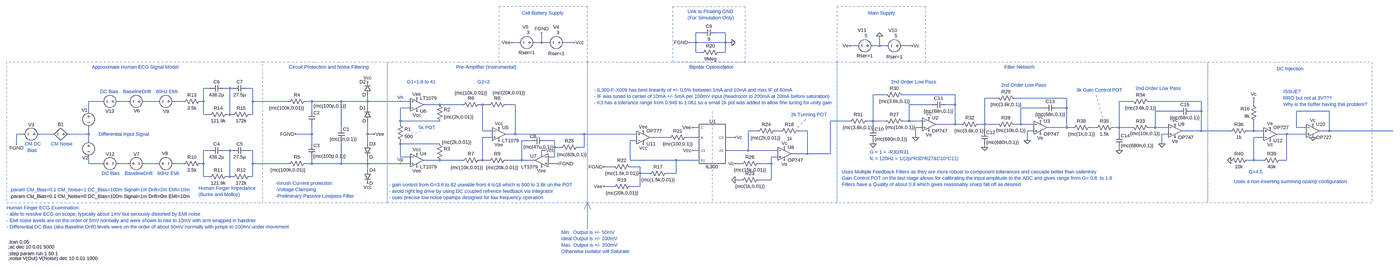
[diagram p0: schematic FrontEnd.asc, whole sheet]
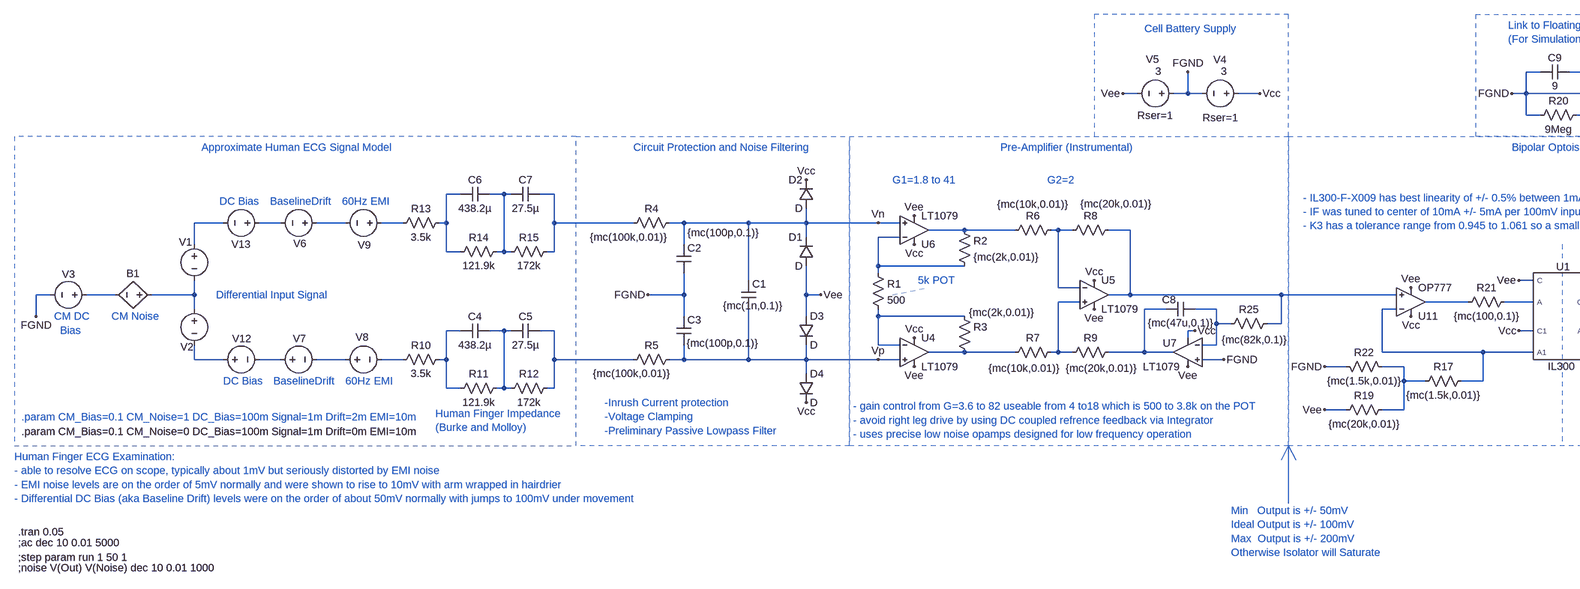
[diagram p1: schematic FrontEnd.asc, part, row 1 of 1, column 1 of 2]
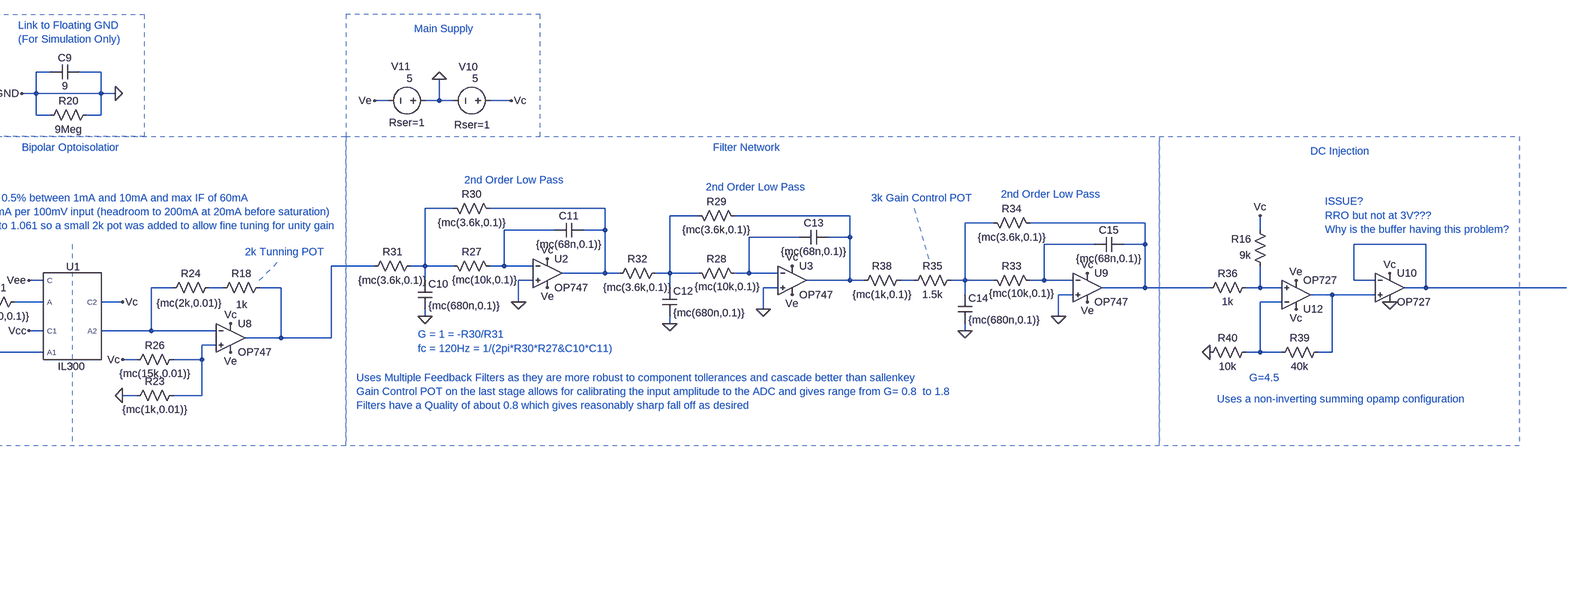
[diagram p2: schematic FrontEnd.asc, part, row 1 of 1, column 2 of 2]
FrontEnd.asc, the LTspice schematic file:
Version 4
SHEET 1 5396 1760
WIRE 1808 -256 1776 -256
WIRE 1920 -256 1872 -256
WIRE 912 -208 880 -208
WIRE 1024 -208 1024 -256
WIRE 1024 -208 992 -208
WIRE 1056 -208 1024 -208
WIRE 1184 -208 1136 -208
WIRE 1776 -208 1776 -256
WIRE 1776 -208 1744 -208
WIRE 1920 -208 1920 -256
WIRE 1920 -208 1776 -208
WIRE 1952 -208 1920 -208
WIRE 2560 -192 2528 -192
WIRE 2672 -192 2672 -240
WIRE 2672 -192 2640 -192
WIRE 2704 -192 2672 -192
WIRE 2832 -192 2784 -192
WIRE 1776 -160 1776 -208
WIRE 1808 -160 1776 -160
WIRE 1920 -160 1920 -208
WIRE 1920 -160 1888 -160
WIRE -592 16 -624 16
WIRE -496 16 -528 16
WIRE -480 16 -496 16
WIRE -384 16 -416 16
WIRE 2704 48 2640 48
WIRE 3040 48 2784 48
WIRE 3248 64 3184 64
WIRE 3584 64 3328 64
WIRE -1120 80 -1184 80
WIRE -992 80 -1040 80
WIRE -848 80 -912 80
WIRE -720 80 -768 80
WIRE -624 80 -624 16
WIRE -624 80 -640 80
WIRE -384 80 -384 16
WIRE -208 80 -384 80
WIRE -96 80 -128 80
WIRE 48 80 -96 80
WIRE 176 80 176 48
WIRE 176 80 48 80
WIRE 336 80 176 80
WIRE 384 80 336 80
WIRE 3904 80 3840 80
WIRE 4240 80 3984 80
WIRE 528 96 448 96
WIRE 640 96 528 96
WIRE 736 96 720 96
WIRE 768 96 736 96
WIRE 896 96 848 96
WIRE 2928 96 2816 96
WIRE 3040 96 3040 48
WIRE 3040 96 2992 96
WIRE 4496 96 4496 64
WIRE 176 112 176 80
WIRE 384 112 336 112
WIRE 3472 112 3360 112
WIRE 3584 112 3584 64
WIRE 3584 112 3536 112
WIRE -1184 128 -1184 80
WIRE -96 128 -96 80
WIRE 4128 128 4016 128
WIRE 4240 128 4240 80
WIRE 4240 128 4192 128
WIRE 4864 128 4704 128
WIRE -624 144 -624 80
WIRE -592 144 -624 144
WIRE -496 144 -496 16
WIRE -496 144 -512 144
WIRE -480 144 -496 144
WIRE -384 144 -384 80
WIRE -384 144 -400 144
WIRE 336 176 336 112
WIRE 528 176 336 176
WIRE 2528 176 2432 176
WIRE 2640 176 2640 48
WIRE 2640 176 2608 176
WIRE 2704 176 2640 176
WIRE 2816 176 2816 96
WIRE 2816 176 2784 176
WIRE 2880 176 2816 176
WIRE 336 192 336 176
WIRE 3040 192 3040 96
WIRE 3040 192 2944 192
WIRE 3072 192 3040 192
WIRE 3184 192 3184 64
WIRE 3184 192 3152 192
WIRE 3248 192 3184 192
WIRE 3360 192 3360 112
WIRE 3360 192 3328 192
WIRE 3424 192 3360 192
WIRE 48 208 48 80
WIRE 1792 208 1760 208
WIRE 2640 208 2640 176
WIRE 2880 208 2848 208
WIRE 3584 208 3584 112
WIRE 3584 208 3488 208
WIRE 3616 208 3584 208
WIRE 3728 208 3696 208
WIRE 3840 208 3840 80
WIRE 3840 208 3808 208
WIRE 3904 208 3840 208
WIRE 4016 208 4016 128
WIRE 4016 208 3984 208
WIRE 4080 208 4016 208
WIRE 4704 208 4704 128
WIRE 4752 208 4704 208
WIRE 736 224 736 96
WIRE 784 224 736 224
WIRE 2080 224 2032 224
WIRE 2192 224 2160 224
WIRE 2320 224 2272 224
WIRE 3184 224 3184 192
WIRE 3424 224 3392 224
WIRE 4240 224 4240 128
WIRE 4240 224 4144 224
WIRE 4384 224 4240 224
WIRE 4496 224 4496 176
WIRE 4496 224 4464 224
WIRE 4544 224 4496 224
WIRE 4864 224 4864 128
WIRE 4864 224 4816 224
WIRE 5392 224 4864 224
WIRE -1504 240 -1536 240
WIRE -1360 240 -1424 240
WIRE -1184 240 -1184 208
WIRE -1184 240 -1280 240
WIRE -96 240 -96 192
WIRE -96 240 -176 240
WIRE 176 240 176 176
WIRE 208 240 176 240
WIRE 896 240 896 96
WIRE 896 240 848 240
WIRE 1232 240 896 240
WIRE 1488 240 1232 240
WIRE 3840 240 3840 208
WIRE 4080 240 4048 240
WIRE 4656 240 4608 240
WIRE 4752 240 4656 240
WIRE 784 256 736 256
WIRE 1648 256 1552 256
WIRE 1792 256 1728 256
WIRE 1968 256 1920 256
WIRE 2848 256 2848 208
WIRE 4544 256 4496 256
WIRE -1184 272 -1184 240
WIRE 976 272 928 272
WIRE 1088 272 1040 272
WIRE 1488 272 1456 272
WIRE 3392 272 3392 224
WIRE -1536 288 -1536 240
WIRE -96 288 -96 240
WIRE 176 288 176 240
WIRE 336 288 336 272
WIRE 528 288 336 288
WIRE 2640 288 2640 272
WIRE 4048 288 4048 240
WIRE 1088 304 1088 272
WIRE 1120 304 1088 304
WIRE 1232 304 1232 240
WIRE 1232 304 1200 304
WIRE 3184 304 3184 288
WIRE -592 320 -624 320
WIRE -496 320 -528 320
WIRE -480 320 -496 320
WIRE -384 320 -416 320
WIRE 1040 320 1024 320
WIRE 1792 320 1760 320
WIRE 2032 320 2032 224
WIRE 2032 320 1920 320
WIRE 2176 320 2032 320
WIRE 3840 320 3840 304
WIRE 1024 336 1024 320
WIRE 2320 336 2320 224
WIRE 2320 336 2240 336
WIRE 2432 336 2432 176
WIRE 2432 336 2320 336
WIRE 336 352 336 288
WIRE 384 352 336 352
WIRE 1088 352 1088 304
WIRE 1088 352 1056 352
WIRE 2176 352 2144 352
WIRE 528 368 448 368
WIRE 640 368 528 368
WIRE 736 368 736 256
WIRE 736 368 720 368
WIRE 768 368 736 368
WIRE 928 368 928 272
WIRE 928 368 848 368
WIRE 992 368 928 368
WIRE 1456 368 1456 272
WIRE 1680 368 1456 368
WIRE 1792 368 1680 368
WIRE 4496 368 4496 256
WIRE 4496 368 4464 368
WIRE 4544 368 4496 368
WIRE 4656 368 4656 240
WIRE 4656 368 4624 368
WIRE -1184 384 -1184 352
WIRE -1120 384 -1184 384
WIRE -992 384 -1040 384
WIRE -848 384 -912 384
WIRE -720 384 -768 384
WIRE -624 384 -624 320
WIRE -624 384 -640 384
WIRE -384 384 -384 320
WIRE -208 384 -384 384
WIRE -96 384 -96 352
WIRE -96 384 -128 384
WIRE 48 384 48 272
WIRE 48 384 -96 384
WIRE 176 384 176 352
WIRE 176 384 48 384
WIRE 336 384 176 384
WIRE 384 384 336 384
WIRE 1104 384 1056 384
WIRE 2000 384 1968 384
WIRE 2144 384 2144 352
WIRE 2144 384 2080 384
WIRE 1376 400 1328 400
WIRE 1504 400 1456 400
WIRE 176 416 176 384
WIRE 1504 432 1504 400
WIRE 1552 432 1504 432
WIRE 1680 432 1680 368
WIRE 1680 432 1632 432
WIRE -624 448 -624 384
WIRE -592 448 -624 448
WIRE -496 448 -496 320
WIRE -496 448 -512 448
WIRE -480 448 -496 448
WIRE -384 448 -384 384
WIRE -384 448 -400 448
WIRE 2000 464 1968 464
WIRE 2144 464 2144 384
WIRE 2144 464 2080 464
WIRE 1376 496 1328 496
WIRE 1504 496 1504 432
WIRE 1504 496 1456 496
FLAG 880 -208 Vee
FLAG 1184 -208 Vcc
FLAG 416 128 Vcc
FLAG 416 336 Vcc
FLAG 416 64 Vee
FLAG 416 400 Vee
FLAG 208 240 Vee
FLAG 176 480 Vcc
FLAG 176 -16 Vcc
FLAG 816 208 Vcc
FLAG 816 272 Vee
FLAG 1520 224 Vee
FLAG 1520 288 Vcc
FLAG 1760 320 Vcc
FLAG 2672 -240 0
FLAG 2528 -192 Ve
FLAG 2832 -192 Vc
FLAG 1968 256 Vc
FLAG 1024 -256 FGND
FLAG -1536 288 FGND
FLAG -176 240 FGND
FLAG 1952 -208 0
FLAG 1744 -208 FGND
FLAG 2208 304 Vc
FLAG 2208 368 Ve
FLAG 1760 208 Vee
FLAG 1328 496 Vee
FLAG 1968 384 Vc
FLAG 1968 464 0
FLAG 1328 400 FGND
FLAG 1104 384 FGND
FLAG 1024 400 Vee
FLAG 1040 320 Vcc
FLAG 336 384 Vp
FLAG 336 80 Vn
FLAG 2912 160 Vc
FLAG 2912 224 Ve
FLAG 2640 288 0
FLAG 2848 256 0
FLAG 3184 304 0
FLAG 3392 272 0
FLAG 3840 320 0
FLAG 4048 288 0
FLAG 3456 176 Vc
FLAG 3456 240 Ve
FLAG 4112 192 Vc
FLAG 4112 256 Ve
FLAG 4576 208 Ve
FLAG 4576 272 Vc
FLAG 4784 192 Vc
FLAG 4384 368 0
FLAG 4496 64 Vc
FLAG 4784 256 0
SYMBOL voltage -1184 112 R0
WINDOW 3 24 96 Invisible 2
WINDOW 39 0 0 Left 2
WINDOW 0 -34 11 Left 2
SYMATTR Value SINE(0 {Signal/2} 10)
SYMATTR InstName V1
SYMATTR Value2 AC {Signal/2}
SYMBOL voltage 1152 -208 R90
WINDOW 123 0 0 Left 2
WINDOW 39 54 16 VRight 2
WINDOW 0 -75 42 VRight 2
WINDOW 3 -49 41 VRight 2
SYMATTR SpiceLine Rser=1
SYMATTR InstName V4
SYMATTR Value 3
SYMBOL voltage 1008 -208 R90
WINDOW 123 0 0 Left 2
WINDOW 39 49 17 VRight 2
WINDOW 0 -76 48 VRight 2
WINDOW 3 -49 43 VRight 2
SYMATTR SpiceLine Rser=1
SYMATTR InstName V5
SYMATTR Value 3
SYMBOL res 320 176 R0
SYMATTR Value 500
SYMATTR InstName R1
SYMBOL res 512 80 R0
SYMATTR InstName R2
SYMATTR Value {mc(2k,0.01)}
SYMBOL res 512 272 R0
WINDOW 3 26 7 Left 2
SYMATTR Value {mc(2k,0.01)}
SYMATTR InstName R3
SYMBOL diode 192 176 R180
WINDOW 0 24 64 Left 2
WINDOW 3 24 0 Left 2
SYMATTR InstName D1
SYMBOL diode 192 48 R180
WINDOW 0 24 64 Left 2
WINDOW 3 24 0 Left 2
SYMATTR InstName D2
SYMBOL diode 160 288 R0
SYMATTR InstName D3
SYMBOL diode 160 416 R0
SYMATTR InstName D4
SYMBOL res -112 64 R90
WINDOW 0 0 56 VBottom 2
WINDOW 3 32 107 VTop 2
SYMATTR InstName R4
SYMATTR Value {mc(100k,0.01)}
SYMBOL res -112 368 R90
WINDOW 0 0 56 VBottom 2
WINDOW 3 32 100 VTop 2
SYMATTR InstName R5
SYMATTR Value {mc(100k,0.01)}
SYMBOL res 736 80 R90
WINDOW 0 0 56 VBottom 2
WINDOW 3 -57 57 VTop 2
SYMATTR InstName R6
SYMATTR Value {mc(10k,0.01)}
SYMBOL res 736 352 R90
WINDOW 0 0 56 VBottom 2
WINDOW 3 36 76 VTop 2
SYMATTR InstName R7
SYMATTR Value {mc(10k,0.01)}
SYMBOL res 864 80 R90
WINDOW 0 0 56 VBottom 2
WINDOW 3 -58 0 VTop 2
SYMATTR InstName R8
SYMATTR Value {mc(20k,0.01)}
SYMBOL res 864 352 R90
WINDOW 0 0 56 VBottom 2
WINDOW 3 36 32 VTop 2
SYMATTR InstName R9
SYMATTR Value {mc(20k,0.01)}
SYMBOL voltage -1184 256 R0
WINDOW 3 24 96 Invisible 2
WINDOW 39 0 0 Left 2
WINDOW 0 -31 100 Left 2
SYMATTR Value SINE(0 {Signal/2} 10)
SYMATTR InstName V2
SYMATTR Value2 AC {Signal/2}
SYMBOL cap 32 208 R0
WINDOW 3 -41 56 Left 2
SYMATTR Value {mc(1n,0.1)}
SYMATTR InstName C1
SYMBOL cap -112 128 R0
WINDOW 3 24 -26 Left 2
SYMATTR Value {mc(100p,0.1)}
SYMATTR InstName C2
SYMBOL cap -112 288 R0
WINDOW 3 22 60 Left 2
SYMATTR Value {mc(100p,0.1)}
SYMATTR InstName C3
SYMBOL bv -1264 240 R90
WINDOW 0 -32 56 VBottom 2
WINDOW 3 32 56 Invisible 2
SYMATTR InstName B1
SYMATTR Value V=white(1e4*time)*{CM_Noise}
SYMBOL voltage -1408 240 R90
WINDOW 3 46 51 Invisible 2
WINDOW 39 0 0 Left 2
WINDOW 0 -46 41 VRight 2
WINDOW 123 0 0 Left 2
SYMATTR Value {CM_Bias}
SYMATTR InstName V3
SYMBOL Opamps\\LT1079 416 304 R0
SYMATTR InstName U4
SYMBOL Opamps\\LT1079 816 176 R0
SYMATTR InstName U5
SYMBOL Opamps\\LT1079 416 160 M180
SYMATTR InstName U6
SYMBOL voltage -896 80 R90
WINDOW 3 43 0 Invisible 2
WINDOW 39 0 0 Left 2
WINDOW 0 46 39 VRight 2
WINDOW 123 0 0 Left 2
SYMATTR Value SINE(0 {Drift/2} 0.5)
SYMATTR InstName V6
SYMBOL voltage -1008 384 R270
WINDOW 3 -41 -57 Invisible 2
WINDOW 39 0 0 Left 2
WINDOW 0 46 43 VRight 2
WINDOW 123 0 0 Left 2
SYMATTR Value SINE(0 {Drift/2} 0.5)
SYMATTR InstName V7
SYMBOL res -624 368 R90
WINDOW 0 0 56 VBottom 2
WINDOW 3 32 56 VTop 2
SYMATTR InstName R10
SYMATTR Value 3.5k
SYMBOL res -496 432 R90
WINDOW 0 0 56 VBottom 2
WINDOW 3 32 56 VTop 2
SYMATTR InstName R11
SYMATTR Value 121.9k
SYMBOL cap -528 304 R90
WINDOW 0 0 32 VBottom 2
WINDOW 3 32 32 VTop 2
SYMATTR InstName C4
SYMATTR Value 438.2µ
SYMBOL cap -416 304 R90
WINDOW 0 0 32 VBottom 2
WINDOW 3 32 32 VTop 2
SYMATTR InstName C5
SYMATTR Value 27.5µ
SYMBOL res -384 432 R90
WINDOW 0 0 56 VBottom 2
WINDOW 3 32 56 VTop 2
SYMATTR InstName R12
SYMATTR Value 172k
SYMBOL res -624 64 R90
WINDOW 0 0 56 VBottom 2
WINDOW 3 32 56 VTop 2
SYMATTR InstName R13
SYMATTR Value 3.5k
SYMBOL res -496 128 R90
WINDOW 0 0 56 VBottom 2
WINDOW 3 32 56 VTop 2
SYMATTR InstName R14
SYMATTR Value 121.9k
SYMBOL cap -528 0 R90
WINDOW 0 0 32 VBottom 2
WINDOW 3 32 32 VTop 2
SYMATTR InstName C6
SYMATTR Value 438.2µ
SYMBOL cap -416 0 R90
WINDOW 0 0 32 VBottom 2
WINDOW 3 32 32 VTop 2
SYMATTR InstName C7
SYMATTR Value 27.5µ
SYMBOL res -384 128 R90
WINDOW 0 0 56 VBottom 2
WINDOW 3 32 56 VTop 2
SYMATTR InstName R15
SYMATTR Value 172k
SYMBOL voltage -864 384 R270
WINDOW 3 -41 -14 Invisible 2
WINDOW 39 0 0 Left 2
WINDOW 0 50 38 VRight 2
WINDOW 123 0 0 Left 2
SYMATTR Value SINE(0 {EMI/2} 60)
SYMATTR InstName V8
SYMBOL voltage -752 80 R90
WINDOW 3 43 -38 Invisible 2
WINDOW 39 0 0 Left 2
WINDOW 0 49 39 VRight 2
WINDOW 123 0 0 Left 2
SYMATTR Value SINE(0 {EMI/2} 60)
SYMATTR InstName V9
SYMBOL res 1648 416 R90
WINDOW 0 0 56 VBottom 2
WINDOW 3 32 56 VTop 2
SYMATTR InstName R17
SYMATTR Value {mc(1.5k,0.01)}
SYMBOL res 2288 208 R90
WINDOW 0 0 56 VBottom 2
WINDOW 3 38 55 VTop 2
SYMATTR InstName R18
SYMATTR Value 1k
SYMBOL voltage 2800 -192 R90
WINDOW 123 0 0 Left 2
WINDOW 39 54 16 VRight 2
WINDOW 0 -75 42 VRight 2
WINDOW 3 -49 41 VRight 2
SYMATTR SpiceLine Rser=1
SYMATTR InstName V10
SYMATTR Value 5
SYMBOL voltage 2656 -192 R90
WINDOW 123 0 0 Left 2
WINDOW 39 49 17 VRight 2
WINDOW 0 -76 48 VRight 2
WINDOW 3 -49 43 VRight 2
SYMATTR SpiceLine Rser=1
SYMATTR InstName V11
SYMATTR Value 5
SYMBOL res 1904 -176 R90
WINDOW 0 0 56 VBottom 2
WINDOW 3 32 56 VTop 2
SYMATTR InstName R20
SYMATTR Value 9Meg
SYMBOL IL300 1856 288 R0
WINDOW 3 -1 111 Center 2
WINDOW 0 -13 -110 Left 2
SYMATTR InstName U1
SYMBOL res 1744 240 R90
WINDOW 0 0 56 VBottom 2
WINDOW 3 32 56 VTop 2
SYMATTR InstName R21
SYMATTR Value {mc(100,0.1)}
SYMBOL res 1984 400 R270
WINDOW 0 32 56 VTop 2
WINDOW 3 0 56 VBottom 2
SYMATTR InstName R26
SYMATTR Value {mc(15k,0.01)}
SYMBOL res 1472 480 R90
WINDOW 0 0 56 VBottom 2
WINDOW 3 32 56 VTop 2
SYMATTR InstName R19
SYMATTR Value {mc(20k,0.01)}
SYMBOL res 1360 384 M90
WINDOW 0 0 56 VBottom 2
WINDOW 3 32 56 VTop 2
SYMATTR InstName R22
SYMATTR Value {mc(1.5k,0.01)}
SYMBOL res 1984 480 R270
WINDOW 0 32 56 VTop 2
WINDOW 3 0 56 VBottom 2
SYMATTR InstName R23
SYMATTR Value {mc(1k,0.01)}
SYMBOL res 2176 208 R90
WINDOW 0 0 56 VBottom 2
WINDOW 3 35 60 VTop 2
SYMATTR InstName R24
SYMATTR Value {mc(2k,0.01)}
SYMBOL voltage -1136 384 R270
WINDOW 3 -43 50 Invisible 2
WINDOW 39 0 0 Left 2
WINDOW 0 46 36 VRight 2
WINDOW 123 0 0 Left 2
SYMATTR Value {DC_Bias/2}
SYMATTR InstName V12
SYMBOL voltage -1024 80 R90
WINDOW 3 -43 50 Invisible 2
WINDOW 39 0 0 Left 2
WINDOW 0 48 35 VRight 2
WINDOW 123 0 0 Left 2
SYMATTR Value {DC_Bias/2}
SYMATTR InstName V13
SYMBOL Opamps\\LT1079 1024 304 M0
WINDOW 0 25 44 Left 2
WINDOW 3 17 96 Left 2
SYMATTR InstName U7
SYMBOL cap 976 288 R270
WINDOW 0 21 6 VTop 2
WINDOW 3 1 32 VBottom 2
SYMATTR InstName C8
SYMATTR Value {mc(47u,0.1)}
SYMBOL res 1216 288 R90
WINDOW 0 0 56 VBottom 2
WINDOW 3 37 44 VTop 2
SYMATTR InstName R25
SYMATTR Value {mc(82k,0.1)}
SYMBOL cap 1872 -272 R90
WINDOW 0 0 32 VBottom 2
WINDOW 3 32 32 VTop 2
SYMATTR InstName C9
SYMATTR Value 9
SYMBOL res 2800 192 M270
WINDOW 0 32 56 VTop 2
WINDOW 3 1 27 VBottom 2
SYMATTR InstName R27
SYMATTR Value {mc(10k,0.1)}
SYMBOL cap 2624 272 M180
WINDOW 0 24 56 Left 2
WINDOW 3 24 8 Left 2
SYMATTR InstName C10
SYMATTR Value {mc(680n,0.1)}
SYMBOL res 2800 64 M270
WINDOW 0 32 56 VTop 2
WINDOW 3 0 56 VBottom 2
SYMATTR InstName R30
SYMATTR Value {mc(3.6k,0.1)}
SYMBOL cap 2992 112 M270
WINDOW 0 32 32 VTop 2
WINDOW 3 0 32 VBottom 2
SYMATTR InstName C11
SYMATTR Value {mc(68n,0.1)}
SYMBOL res 2624 160 R90
WINDOW 0 0 56 VBottom 2
WINDOW 3 32 56 VTop 2
SYMATTR InstName R31
SYMATTR Value {mc(3.6k,0.1)}
SYMBOL res 3344 208 M270
WINDOW 0 32 56 VTop 2
WINDOW 3 2 32 VBottom 2
SYMATTR InstName R28
SYMATTR Value {mc(10k,0.1)}
SYMBOL cap 3168 288 M180
WINDOW 0 24 56 Left 2
WINDOW 3 24 8 Left 2
SYMATTR InstName C12
SYMATTR Value {mc(680n,0.1)}
SYMBOL res 3344 80 M270
WINDOW 0 32 56 VTop 2
WINDOW 3 0 56 VBottom 2
SYMATTR InstName R29
SYMATTR Value {mc(3.6k,0.1)}
SYMBOL cap 3536 128 M270
WINDOW 0 32 32 VTop 2
WINDOW 3 0 32 VBottom 2
SYMATTR InstName C13
SYMATTR Value {mc(68n,0.1)}
SYMBOL res 3168 176 R90
WINDOW 0 0 56 VBottom 2
WINDOW 3 32 56 VTop 2
SYMATTR InstName R32
SYMATTR Value {mc(3.6k,0.1)}
SYMBOL res 4000 224 M270
WINDOW 0 32 56 VTop 2
WINDOW 3 3 34 VBottom 2
SYMATTR InstName R33
SYMATTR Value {mc(10k,0.1)}
SYMBOL cap 3824 304 M180
WINDOW 0 24 56 Left 2
WINDOW 3 24 8 Left 2
SYMATTR InstName C14
SYMATTR Value {mc(680n,0.1)}
SYMBOL res 4000 96 M270
WINDOW 0 32 56 VTop 2
WINDOW 3 0 56 VBottom 2
SYMATTR InstName R34
SYMATTR Value {mc(3.6k,0.1)}
SYMBOL cap 4192 144 M270
WINDOW 0 32 32 VTop 2
WINDOW 3 0 32 VBottom 2
SYMATTR InstName C15
SYMATTR Value {mc(68n,0.1)}
SYMBOL res 3824 192 R90
WINDOW 0 0 56 VBottom 2
WINDOW 3 32 56 VTop 2
SYMATTR InstName R35
SYMATTR Value 1.5k
SYMBOL Opamps\\OP777 1520 320 M180
SYMATTR InstName U11
SYMBOL Opamps\\OP747 2208 272 R0
SYMATTR InstName U8
SYMBOL Opamps\\OP747 2912 128 R0
SYMATTR InstName U2
SYMBOL Opamps\\OP747 3456 144 R0
SYMATTR InstName U3
SYMBOL Opamps\\OP747 4112 160 R0
SYMATTR InstName U9
SYMBOL Opamps\\OP727 4576 304 M180
SYMATTR InstName U12
SYMBOL res 4480 208 R90
WINDOW 0 0 56 VBottom 2
WINDOW 3 32 56 VTop 2
SYMATTR InstName R36
SYMATTR Value 1k
SYMBOL res 4640 352 R90
WINDOW 0 0 56 VBottom 2
WINDOW 3 32 56 VTop 2
SYMATTR InstName R39
SYMATTR Value 40k
SYMBOL res 4480 352 R90
WINDOW 0 0 56 VBottom 2
WINDOW 3 32 56 VTop 2
SYMATTR InstName R40
SYMATTR Value 10k
SYMBOL res 4512 192 R180
WINDOW 0 36 76 Left 2
WINDOW 3 36 40 Left 2
SYMATTR InstName R16
SYMATTR Value 9k
SYMBOL res 3712 192 R90
WINDOW 0 0 56 VBottom 2
WINDOW 3 32 56 VTop 2
SYMATTR InstName R38
SYMATTR Value {mc(1k,0.1)}
SYMBOL Opamps\\OP727 4784 160 R0
SYMATTR InstName U10
TEXT -1576 768 Left 2 !.tran 0.05
TEXT -1576 792 Left 2 !;ac dec 10 0.01 5000
TEXT -1576 848 Left 2 !;noise V(Out) V(Noise) dec 10 0.01 1000
TEXT -272 480 Left 2 ;-Inrush Current protection\n-Voltage Clamping\n-Preliminary Passive Lowpass Filter
TEXT -1496 288 Left 2 ;CM DC\n  Bias
TEXT -1368 288 Left 2 ;CM Noise
TEXT -1136 240 Left 2 ;Differential Input Signal
TEXT -1008 432 Left 2 ;BaselineDrift
TEXT -1168 -88 Left 2 ;Approximate Human ECG Signal Model
TEXT -648 504 Left 2 ;Human Finger Impedance\n(Burke and Molloy)
TEXT 608 -88 Left 2 ;Pre-Amplifier (Instrumental)
TEXT -848 432 Left 2 ;60Hz EMI
TEXT 928 -352 Left 2 ;Cell Battery Supply
TEXT -208 -88 Left 2 ;Circuit Protection and Noise Filtering
TEXT -1576 824 Left 2 !;step param run 1 50 1
TEXT 2616 -352 Left 2 ;Main Supply
TEXT 1736 -360 Left 2 ;Link to Floating GND\n(For Simulation Only)
TEXT 1744 -88 Left 2 ;Bipolar Optoisolatior
TEXT 1120 720 Left 2 ;Min   Output is +/- 50mV\nIdeal Output is +/- 100mV\nMax  Output is +/- 200mV\nOtherwise Isolator will Saturate
TEXT 280 488 Left 2 ;- gain control from G=3.6 to 82 useable from 4 to18 which is 500 to 3.8k on the POT\n- avoid right leg drive by using DC coupled refrence feedback via Integrator\n- uses precise low noise opamps designed for low frequency operation
TEXT 1280 24 Left 2 ;- IL300-F-X009 has best linearity of +/- 0.5% between 1mA and 10mA and max IF of 60mA\n- IF was tuned to center of 10mA +/- 5mA per 100mV input (headroom to 200mA at 20mA before saturation)\n- K3 has a tolerance range from 0.945 to 1.061 so a small 2k pot was added to allow fine tuning for unity gain
TEXT 2240 144 Left 2 ;2k Tunning POT
TEXT -1120 432 Left 2 ;DC Bias
TEXT -1016 32 Left 2 ;BaselineDrift
TEXT -856 32 Left 2 ;60Hz EMI
TEXT -1128 32 Left 2 ;DC Bias
TEXT -1568 544 Left 2 !.param CM_Bias=0.1 CM_Noise=0 DC_Bias=100m Signal=1m Drift=0m EMI=10m
TEXT 368 -16 Left 2 ;G1=1.8 to 41
TEXT 712 -16 Left 2 ;G2=2
TEXT 424 208 Left 2 ;5k POT
TEXT 2624 328 Left 2 ;G = 1 = -R30/R31\nfc = 120Hz = 1/(2pi*R30*R27&C10*C11)
TEXT 2488 424 Left 2 ;Uses Multiple Feedback Filters as they are more robust to component tollerances and cascade better than sallenkey\nGain Control POT on the last stage allows for calibrating the input amplitude to the ADC and gives range from G= 0.8  to 1.8\nFilters have a Quality of about 0.8 which gives reasonably sharp fall off as desired
TEXT 3280 -88 Left 2 ;Filter Network
TEXT -1584 600 Left 2 ;Human Finger ECG Examination:\n- able to resolve ECG on scope, typically about 1mV but seriously distorted by EMI noise\n- EMI noise levels are on the order of 5mV normally and were shown to rise to 10mV with arm wrapped in hairdrier\n- Differential DC Bias (aka Baseline Drift) levels were on the order of about 50mV normally with jumps to 100mV under movement
TEXT 3632 24 Left 2 ;3k Gain Control POT
TEXT -1568 512 Left 2 ;.param CM_Bias=0.1 CM_Noise=1 DC_Bias=100m Signal=1m Drift=2m EMI=10m
TEXT 2728 -16 Left 2 ;2nd Order Low Pass
TEXT 3264 0 Left 2 ;2nd Order Low Pass
TEXT 3920 16 Left 2 ;2nd Order Low Pass
TEXT 4640 32 Left 2 ;ISSUE?\nRRO but not at 3V???\nWhy is the buffer having this problem?
TEXT 4472 424 Left 2 ;G=4.5
TEXT 4608 -80 Left 2 ;DC Injection
TEXT 4400 472 Left 2 ;Uses a non-inverting summing opamp configuration
LINE Normal 1248 576 1248 704
LINE Normal 1248 576 1232 608
LINE Normal 1264 608 1248 576
LINE Normal 2272 208 2320 160 2
LINE Normal 368 240 448 224 2
LINE Normal 1856 128 1856 576 2
LINE Normal 3760 160 3728 48 2
RECTANGLE Normal -1584 576 -336 -112 2
RECTANGLE Normal 272 576 -336 -112 2
RECTANGLE Normal 816 -112 1248 -384 2
RECTANGLE Normal 2464 -112 2896 -384 2
RECTANGLE Normal 1248 576 272 -112 2
RECTANGLE Normal 2016 -112 1664 -384 2
RECTANGLE Normal 2464 576 1248 -112 2
RECTANGLE Normal 4272 576 2464 -112 2
RECTANGLE Normal 5072 576 4272 -112 2

The netlist it stands for:
* FrontEnd.asc
V1 N008 N028 SINE(0 {Signal/2} 10) AC {Signal/2}
V4 Vcc 0 3 Rser=1
V5 0 Vee 3 Rser=1
R1 N018 N037 500
R2 N014 N018 {mc(2k,0.01)}
R3 N037 N042 {mc(2k,0.01)}
D1 Vee Vn D
D2 Vn Vcc D
D3 Vee Vp D
D4 Vp Vcc D
R4 Vn N003 {mc(100k,0.01)}
R5 Vp N040 {mc(100k,0.01)}
R6 N015 N014 {mc(10k,0.01)}
R7 N030 N042 {mc(10k,0.01)}
R8 N016 N015 {mc(20k,0.01)}
R9 N034 N030 {mc(20k,0.01)}
V2 N028 N043 SINE(0 {Signal/2} 10) AC {Signal/2}
C1 Vn Vp {mc(1n,0.1)}
C2 Vn 0 {mc(100p,0.1)}
C3 0 Vp {mc(100p,0.1)}
B1 N028 N027 V=white(1e4*time)*{CM_Noise}
V3 N027 0 {CM_Bias}
XU4 Vp N037 Vcc Vee N042 LT1079  ; pins In+ In- V+ V- OUT
XU5 N030 N015 Vcc Vee N016 LT1079  ; pins In+ In- V+ V- OUT
XU6 Vn N018 Vcc Vee N014 LT1079  ; pins In+ In- V+ V- OUT
V6 N010 N009 SINE(0 {Drift/2} 0.5)
V7 N044 N045 SINE(0 {Drift/2} 0.5)
R10 N038 N046 3.5k
R11 N039 N038 121.9k
C4 N039 N038 438.2µ
C5 N040 N039 27.5µ
R12 N040 N039 172k
R13 N001 N011 3.5k
R14 N002 N001 121.9k
C6 N002 N001 438.2µ
C7 N003 N002 27.5µ
R15 N003 N002 172k
V8 N045 N046 SINE(0 {EMI/2} 60)
V9 N011 N010 SINE(0 {EMI/2} 60)
R17 N036 N047 {mc(1.5k,0.01)}
R18 N022 N025 1k
V10 Vc 0 5 Rser=1
V11 0 Ve 5 Rser=1
R20 0 0 9Meg
XU1 N032 Vee N036 Vcc N024 Vc IL300 IL300  ; pins A C A1 C1 A2 C2
R21 N032 N031 {mc(100,0.1)}
R26 Vc N041 {mc(15k,0.01)}
R19 N047 Vee {mc(20k,0.01)}
R22 0 N047 {mc(1.5k,0.01)}
R23 0 N041 {mc(1k,0.01)}
R24 N025 N024 {mc(2k,0.01)}
V12 N043 N044 {DC_Bias/2}
V13 N009 N008 {DC_Bias/2}
XU7 0 N035 Vcc Vee N034 LT1079  ; pins In+ In- V+ V- OUT
C8 N034 N035 {mc(47u,0.1)}
R25 N016 N035 {mc(82k,0.1)}
C9 0 0 9
R27 N017 N004 {mc(10k,0.1)}
C10 0 N004 {mc(680n,0.1)}
R30 N005 N004 {mc(3.6k,0.1)}
C11 N005 N017 {mc(68n,0.1)}
R31 N004 N022 {mc(3.6k,0.1)}
R28 N019 N006 {mc(10k,0.1)}
C12 0 N006 {mc(680n,0.1)}
R29 N007 N006 {mc(3.6k,0.1)}
C13 N007 N019 {mc(68n,0.1)}
R32 N006 N005 {mc(3.6k,0.1)}
R33 N020 N012 {mc(10k,0.1)}
C14 0 N012 {mc(680n,0.1)}
R34 N013 N012 {mc(3.6k,0.1)}
C15 N013 N020 {mc(68n,0.1)}
R35 N012 N023 1.5k
XU11 N016 N036 Vcc Vee N031 OP777  ; pins In+ In- V+ V- OUT
XU8 N041 N024 Vc Ve N022 OP747  ; pins In+ In- V+ V- OUT
XU2 0 N017 Vc Ve N005 OP747  ; pins In+ In- V+ V- OUT
XU3 0 N019 Vc Ve N007 OP747  ; pins In+ In- V+ V- OUT
XU9 0 N020 Vc Ve N013 OP747  ; pins In+ In- V+ V- OUT
XU12 N026 N033 Vc Ve N029 OP727  ; pins In+ In- V+ V- OUT
R36 N026 N013 1k
R39 N029 N033 40k
R40 N033 0 10k
R16 N026 Vc 9k
R38 N023 N007 {mc(1k,0.1)}
XU10 N029 N021 Vc 0 N021 OP727  ; pins In+ In- V+ V- OUT
.model D D
.lib standard.dio
.tran 0.05
;ac dec 10 0.01 5000
;noise V(Out) V(Noise) dec 10 0.01 1000
* -Inrush Current protection
* -Voltage Clamping
* -Preliminary Passive Lowpass Filter
* CM DC
*   Bias
* CM Noise
* Differential Input Signal
* BaselineDrift
* Approximate Human ECG Signal Model
* Human Finger Impedance
* (Burke and Molloy)
* Pre-Amplifier (Instrumental)
* 60Hz EMI
* Cell Battery Supply
* Circuit Protection and Noise Filtering
;step param run 1 50 1
* Main Supply
* Link to Floating GND
* (For Simulation Only)
* Bipolar Optoisolatior
* Min   Output is +/- 50mV
* Ideal Output is +/- 100mV
* Max  Output is +/- 200mV
* Otherwise Isolator will Saturate
* - gain control from G=3.6 to 82 useable from 4 to18 which is 500 to 3.8k on the POT
* - avoid right leg drive by using DC coupled refrence feedback via Integrator
* - uses precise low noise opamps designed for low frequency operation
* - IL300-F-X009 has best linearity of +/- 0.5% between 1mA and 10mA and max IF of 60mA
* - IF was tuned to center of 10mA +/- 5mA per 100mV input (headroom to 200mA at 20mA before saturation)
* - K3 has a tolerance range from 0.945 to 1.061 so a small 2k pot was added to allow fine tuning for unity gain
* 2k Tunning POT
* DC Bias
* BaselineDrift
* 60Hz EMI
* DC Bias
.param CM_Bias=0.1 CM_Noise=0 DC_Bias=100m Signal=1m Drift=0m EMI=10m
* G1=1.8 to 41
* G2=2
* 5k POT
* G = 1 = -R30/R31
* fc = 120Hz = 1/(2pi*R30*R27&C10*C11)
* Uses Multiple Feedback Filters as they are more robust to component tollerances and cascade better than sallenkey
* Gain Control POT on the last stage allows for calibrating the input amplitude to the ADC and gives range from G= 0.8  to 1.8
* Filters have a Quality of about 0.8 which gives reasonably sharp fall off as desired
* Filter Network
* Human Finger ECG Examination:
* - able to resolve ECG on scope, typically about 1mV but seriously distorted by EMI noise
* - EMI noise levels are on the order of 5mV normally and were shown to rise to 10mV with arm wrapped in hairdrier
* - Differential DC Bias (aka Baseline Drift) levels were on the order of about 50mV normally with jumps to 100mV under movement
* 3k Gain Control POT
* .param CM_Bias=0.1 CM_Noise=1 DC_Bias=100m Signal=1m Drift=2m EMI=10m
* 2nd Order Low Pass
* 2nd Order Low Pass
* 2nd Order Low Pass
* ISSUE?
* RRO but not at 3V???
* Why is the buffer having this problem?
* G=4.5
* DC Injection
* Uses a non-inverting summing opamp configuration
.lib IL300.sub
.lib ADI.lib
.backanno
.end